# Altium schematic sheet Schematics.SchDoc
size A4
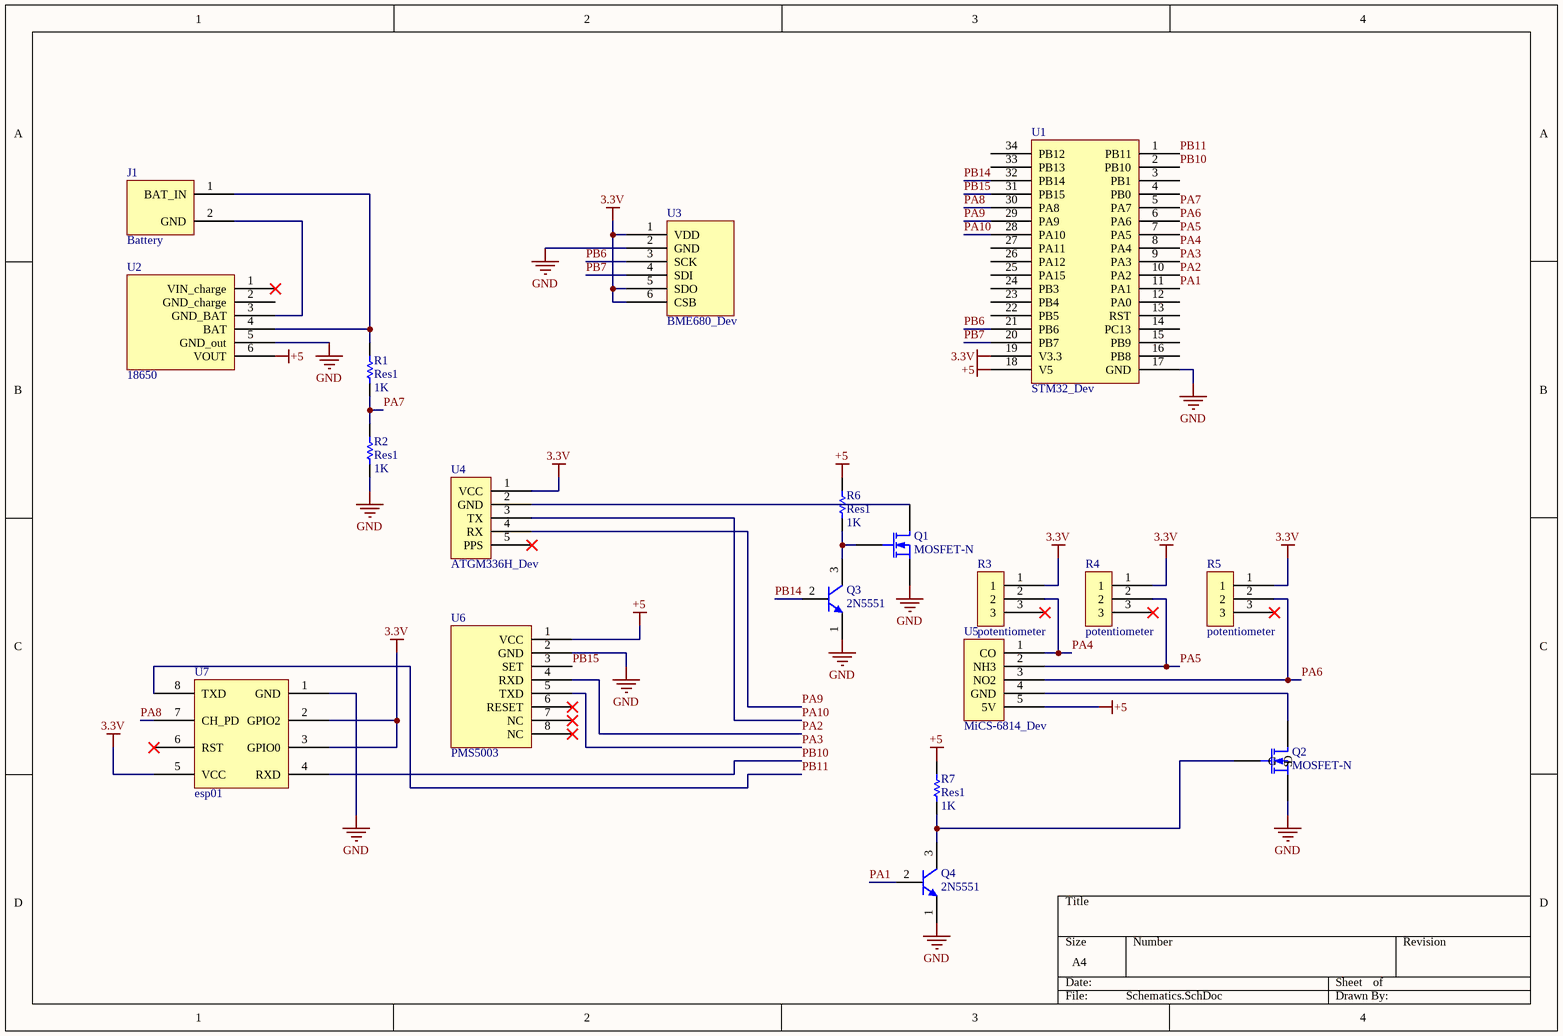
[diagram p0: Schematics.SchDoc]

## Parts
J1  Battery  [Battery]
Q1  MOSFET-N  [TO-220-AB]
Q2  MOSFET-N  [TO-220-AB]
Q3  2N5551  [TO-92A]
Q4  2N5551  [TO-92A]
R1  Res1  value 1K  [AXIAL-0.3]
R2  Res1  value 1K  [AXIAL-0.3]
R3  potentiometer  [potentiometer]
R4  potentiometer  [potentiometer]
R5  potentiometer  [potentiometer]
R6  Res1  value 1K  [AXIAL-0.3]
R7  Res1  value 1K  [AXIAL-0.3]
U1  STM32_Dev  [STM32_Dev]
U2  18650  [18650_Manage]
U3  BME680_Dev  [BME680_Dev]
U4  ATGM336H_Dev  [AGTM336H_Dev]
U5  MiCS-6814_Dev  [MiCS6814]
U6  PMS5003  [PMS5003]
U7  esp01  [ESP01]

## Nets
3.3V: R3.1 R4.1 R5.1 U1.19(V3.3) U3.1(VDD) U3.5(SDO) U3.6(CSB) U4.1(VCC) U7.2(GPIO2) U7.3(GPIO0) U7.5(VCC)
+5: R6.2 R7.2 U1.18(V5) U2.6(VOUT) U5.5(5V) U6.1(VCC)
GND: Q1.3(S) Q2.3(S) Q3.1(E) Q4.1(E) R2.1 U1.17(GND) U2.5(GND_out) U3.2(GND) U6.2(GND) U7.1(GND)
PA1: Q4.2(B) U1.11(PA1)
PA2: U1.10(PA2) U6.4(RXD)
PA3: U1.9(PA3) U6.5(TXD)
PA4: R3.2 U1.8(PA4) U5.1(CO)
PA5: R4.2 U1.7(PA5) U5.2(NH3)
PA6: R5.2 U1.6(PA6) U5.3(NO2)
PA7: R1.1 R2.2 U1.5(PA7)
PA8: U1.30(PA8) U7.7(CH_PD)
PA9: U1.29(PA9) U4.4(RX)
PA10: U1.28(PA10) U4.3(TX)
PB6: U1.21(PB6) U3.3(SCK)
PB7: U1.20(PB7) U3.4(SDI)
PB10: U1.2(PB10) U7.4(RXD)
PB11: U1.1(PB11) U7.8(TXD)
PB14: Q3.2(B) U1.32(PB14)
PB15: U1.31(PB15) U6.3(SET)
NetJ1_1: J1.1(BAT_IN) R1.2 U2.4(BAT)
NetJ1_2: J1.2(GND) U2.3(GND_BAT)
NetQ1_1: Q1.1(G) Q3.3(C) R6.1
NetQ1_2: Q1.2(D) U4.2(GND)
NetQ2_1: Q2.1(G) Q4.3(C) R7.1
NetQ2_2: Q2.2(D) U5.4(GND)

Not connected (* = marked no-connect by the designer): R3 3*; R4 3*; R5 3*; U1 3(PB1) 4(PB0) 12(PA0) 13(RST) 14(PC13) 15(PB9) 16(PB8) 22(PB5) 23(PB4) 24(PB3) 25(PA15) 26(PA12) 27(PA11) 33(PB13) 34(PB12); U2 1(VIN_charge)* 2(GND_charge); U4 5(PPS)*; U6 6(RESET)* 7(NC)* 8(NC)*; U7 6(RST)*

## Library data of the parts
Q1 Q2 = MOSFET-N: N-Channel MOSFET; Published: 8-Jun-2000; LatestRevisionDate: 17-Jul-2002; LatestRevisionNote: Re-released for DXP Platform.; PackageVersion: 1995/1996; PackageReference: E3; Publisher: Altium Limited; PackageDescription: TO, Flat Index; 3 In-Line, Axial Leads; Body Dia. 4.6mm; Lead Dia. 0.5 mm (max)
Q3 Q4 = 2N3904: NPN General Purpose Amplifier; Published: 8-Jun-2000; LatestRevisionDate: 15-Jan-2003; LatestRevisionNote: PCB Footprint 'BCY-W3/D4.7' replaced; DatasheetVersion: 1997; PackageVersion: Sep-1998; PackageReference: TO-92A; Publisher: Altium Limited; PackageDescription: TO, Flat Index; 3 In-Line, Axial Leads; Body Dia. 4.5mm; Leads 0.51 x 0.48 mm (max); ComponentLink1Description: Manufacturer Link; ComponentLink1URL: http://www.fairchildsemi.com/; ComponentLink2Description: Datasheet; ComponentLink2URL: http://www.fairchildsemi.com/ds/2N%2F2N3904.pdf
R1 R2 R6 R7 = Res1: Resistor; Published: 8-Jun-2000; LatestRevisionDate: 17-Jul-2002; LatestRevisionNote: Re-released for DXP Platform.; PackageReference: AXIAL-0.3; Publisher: Altium Limited; PackageDescription: Axial Device, Thru-Hole; 2 Leads; 0.3 in Pin Spacing